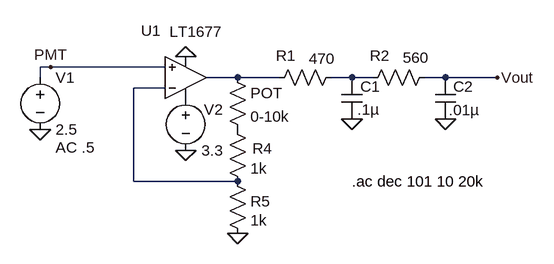
[diagram p0: schematic PMTLowPassFilter.asc]
PMTLowPassFilter.asc, the LTspice schematic file:
Version 4
SHEET 1 880 680
WIRE -208 80 -224 80
WIRE -32 80 -208 80
WIRE -224 96 -224 80
WIRE 80 96 32 96
WIRE 144 96 80 96
WIRE 256 96 224 96
WIRE 288 96 256 96
WIRE 400 96 368 96
WIRE 480 96 400 96
WIRE -32 112 -80 112
WIRE -80 256 -80 112
WIRE 80 256 -80 256
FLAG -224 176 0
FLAG 256 160 0
FLAG 400 160 0
FLAG -208 80 PMT
FLAG 480 96 Vout
FLAG 0 208 0
FLAG 0 64 0
FLAG 80 336 0
SYMBOL res 240 80 R90
WINDOW 0 -2 86 VBottom 2
WINDOW 3 -29 30 VTop 2
SYMATTR InstName R1
SYMATTR Value 470
SYMBOL res 384 80 R90
WINDOW 0 -2 85 VBottom 2
WINDOW 3 -30 29 VTop 2
SYMATTR InstName R2
SYMATTR Value 560
SYMBOL cap 240 96 R0
WINDOW 0 29 14 Left 2
WINDOW 3 24 49 Left 2
SYMATTR InstName C1
SYMATTR Value .1µ
SYMBOL cap 384 96 R0
WINDOW 0 28 14 Left 2
WINDOW 3 21 50 Left 2
SYMATTR InstName C2
SYMATTR Value .01µ
SYMBOL voltage -224 80 R0
WINDOW 123 24 124 Left 2
WINDOW 39 0 0 Left 2
SYMATTR Value2 AC .5
SYMATTR InstName V1
SYMATTR Value 2.5
SYMBOL voltage 0 112 R0
WINDOW 0 28 33 Left 2
WINDOW 123 0 0 Left 2
WINDOW 39 0 0 Left 2
SYMATTR InstName V2
SYMATTR Value 3.3
SYMBOL Opamps\\LT1677 0 160 M180
WINDOW 0 -69 136 Left 2
WINDOW 3 -25 135 Left 2
SYMATTR InstName U1
SYMBOL res 64 80 R0
SYMATTR InstName POT
SYMATTR Value 0-10k
SYMBOL res 64 160 R0
WINDOW 0 39 45 Left 2
SYMATTR InstName R4
SYMATTR Value 1k
SYMBOL res 64 240 R0
WINDOW 0 36 47 Left 2
SYMATTR InstName R5
SYMATTR Value 1k
TEXT 256 256 Left 2 !.ac dec 101 10 20k

The netlist it stands for:
* PMTLowPassFilter.asc
R1 N002 N001 470
R2 Vout N002 560
C1 N002 0 .1µ
C2 Vout 0 .01µ
V1 PMT 0 2.5 AC .5
V2 P001 0 3.3
XU1 PMT N003 P001 0 N001 LT1677  ; pins In+ In- V+ V- OUT
R§POT N001 P002 0-10k
R4 P002 N003 1k
R5 N003 0 1k
.ac dec 101 10 20k
.lib LTC.lib
.backanno
.end